# Altium schematic sheet Gimbal_PCB_2017_MCU.SchDoc
size A4
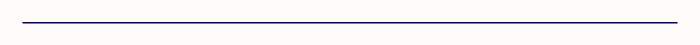
[diagram p0: Gimbal_PCB_2017_MCU.SchDoc]